# EAGLE design gpsclock (EAGLE 7.4.0)
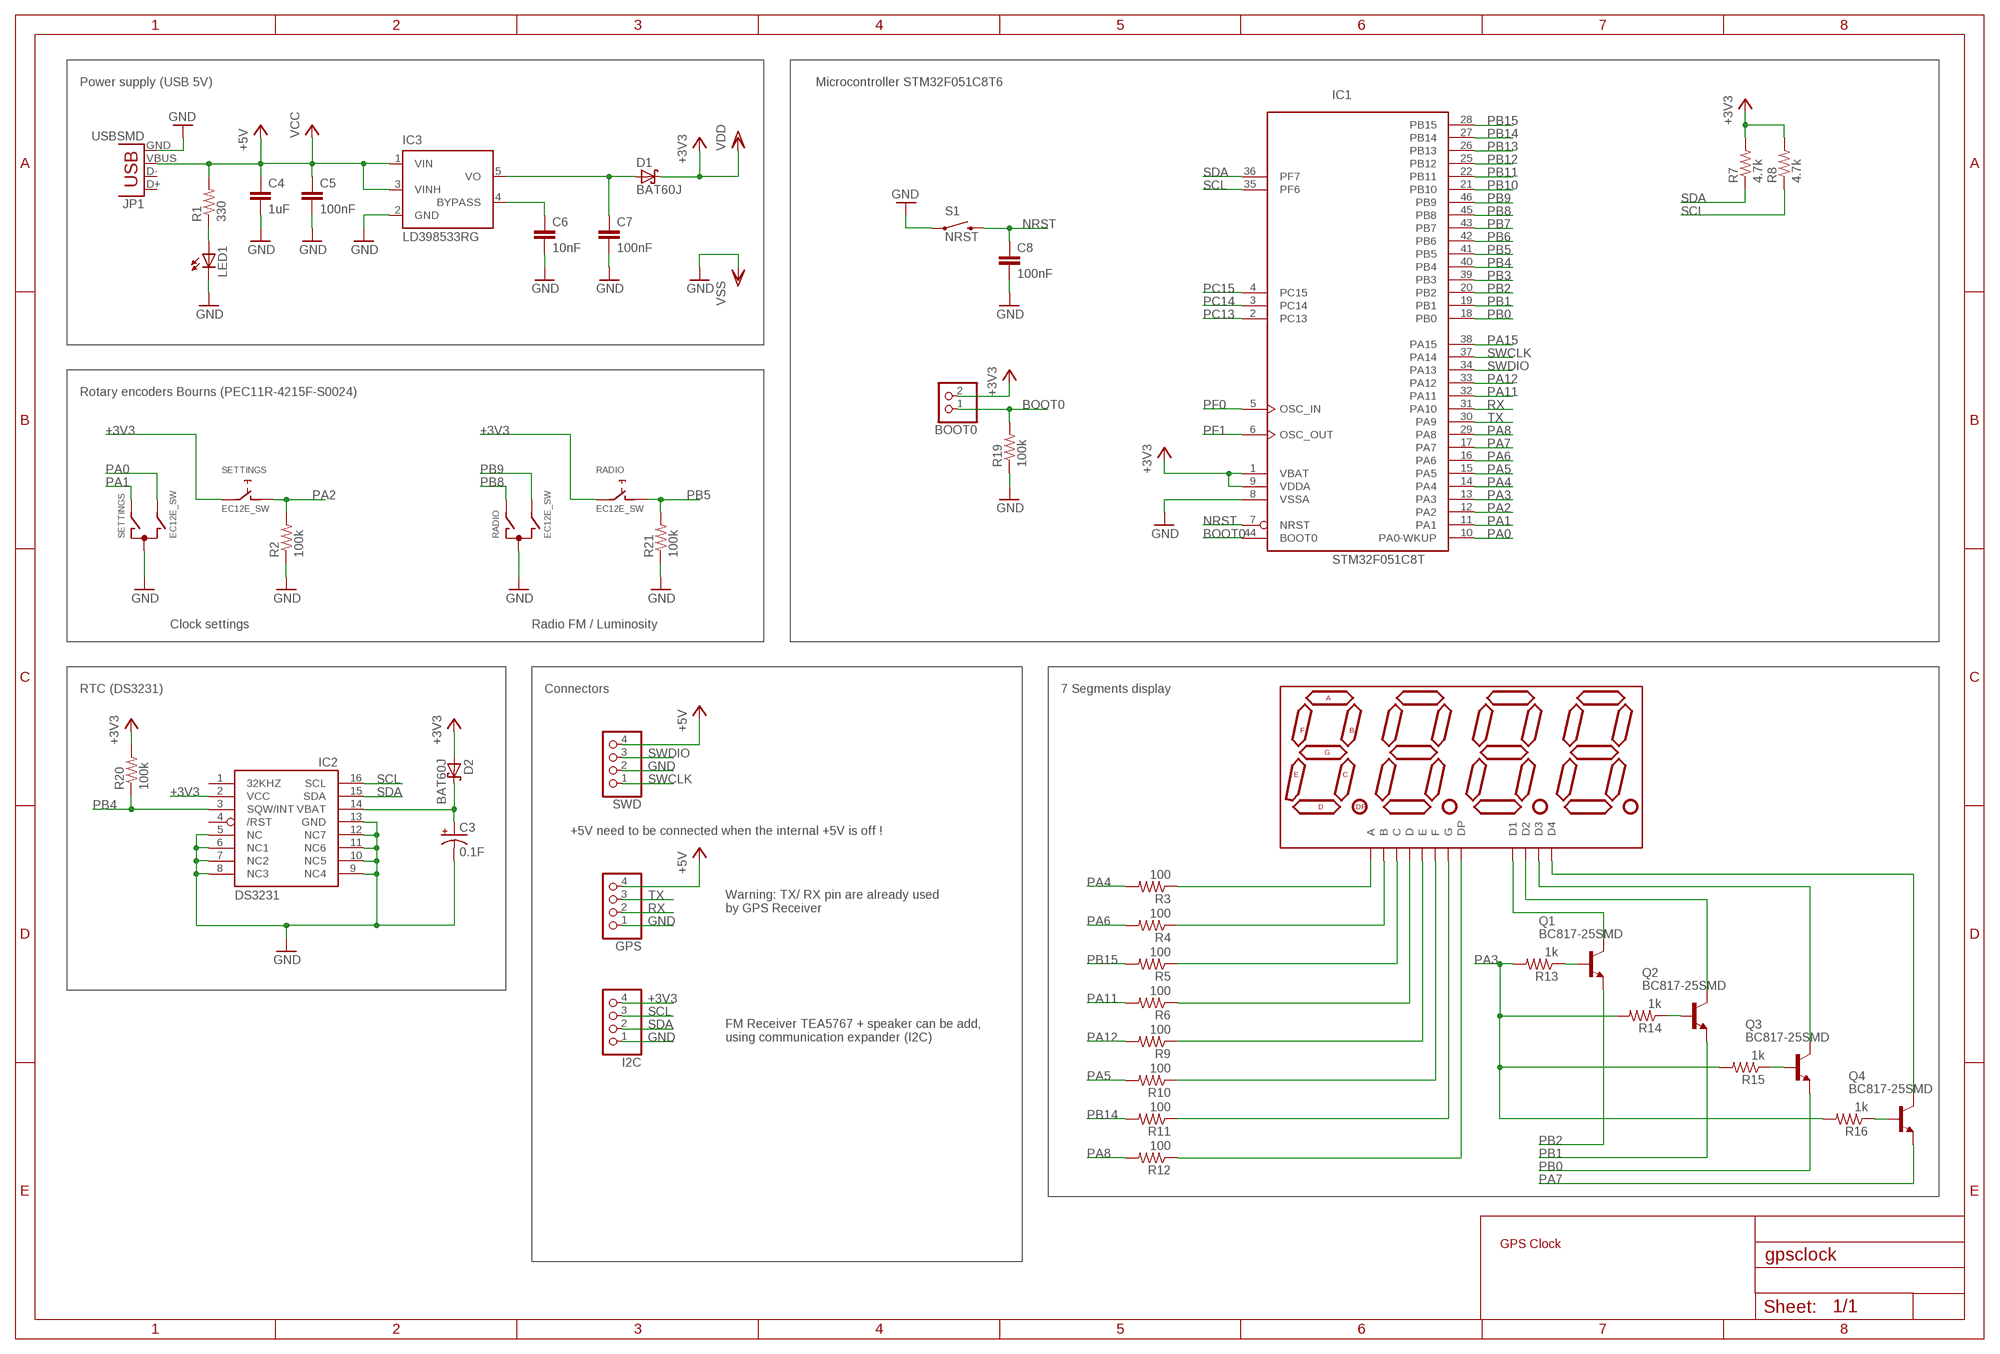
[diagram p0: schematic, sheet 1]

## Parts
7SEG  7-SEGMENT-4DIGIT-COUNTER  [CC56-21SURKWA]
BOOT0  PINHD-1X2  [1X02]
C3  0.1F  CAP_POLPTH4  [CPOL-RADIAL-1000UF-25V]
C4  1uF  C-EUC0805  [C0805]
C5  100nF  C-EUC1206  [C1206]
C6  10nF  C-EUC0805  [C0805]
C7  100nF  C-EUC1206  [C1206]
C8  100nF  C-EUC1206  [C1206]
D1  BAT60J  [SOD323_ST]
D2  BAT60J  [SOD323_ST]
GPS  PINHD-1X4  [1X04]
I2C  PINHD-1X4  [1X04]
IC1  STM32F051C8T  [LQFP48]
IC2  DS3231/SO  [SO16W]
IC3  LD398533RG  [TSOT23-5L]
JP1  USBSMD  [USB-MINIB]
LED1  LEDCHIPLED_1206  [CHIPLED_1206]
Q1  BC817-25SMD  [SOT23-BEC]
Q2  BC817-25SMD  [SOT23-BEC]
Q3  BC817-25SMD  [SOT23-BEC]
Q4  BC817-25SMD  [SOT23-BEC]
R1  330  R-US_R1206  [R1206]
R2  100k  R-US_R1206  [R1206]
R3  100  R-US_R1206  [R1206]
R4  100  R-US_R1206  [R1206]
R5  100  R-US_R1206  [R1206]
R6  100  R-US_R1206  [R1206]
R7  4.7k  R-US_R0805  [R0805]
R8  4.7k  R-US_R0805  [R0805]
R9  100  R-US_R1206  [R1206]
R10  100  R-US_R1206  [R1206]
R11  100  R-US_R1206  [R1206]
R12  100  R-US_R1206  [R1206]
R13  1k  R-US_R1206  [R1206]
R14  1k  R-US_R1206  [R1206]
R15  1k  R-US_R1206  [R1206]
R16  1k  R-US_R1206  [R1206]
R19  100k  R-US_R1206  [R1206]
R20  100k  R-US_R1206  [R1206]
R21  100k  R-US_R1206  [R1206]
RADIO  EC12E_SW  [ALPS_EC12E_SW]
S1  NRST  SWITCH-MOMENTARY-2SMD-REDUNDANT  [TACTILE-SWITCH-SMD]
SETTINGS  EC12E_SW  [ALPS_EC12E_SW]
SWD  PINHD-1X4  [1X04]

## Nets
+3V3: BOOT0.2 D1.C D2.A I2C.4 IC1.1(VBAT) IC1.9(VDDA) IC2.2(VCC) R7.2 R8.2 R20.2 RADIO.E SETTINGS.E ; supply symbol labelled VDD
+5V: C4.1 C5.1 GPS.4 IC3.1(VIN) IC3.3(VINH) JP1.VBUS R1.2 SWD.4 ; supply symbol labelled VCC
BOOT0: BOOT0.1 IC1.44(BOOT0) R19.2
GND: C3.2(-) C4.2 C5.2 C6.2 C7.2 C8.2 GPS.1 I2C.1 IC1.8(VSSA) IC2.5(NC) IC2.6(NC1) IC2.7(NC2) IC2.8(NC3) IC2.9(NC4) IC2.10(NC5) IC2.11(NC6) IC2.12(NC7) IC2.13(GND) IC3.2(GND) JP1.GND LED1.C R2.1 R19.1 R21.1 RADIO.C S1.1 S1.2 SETTINGS.C SWD.2 ; supply symbol labelled VSS
N$1: 7SEG.10(F) R10.1
N$2: 7SEG.9(D2) Q2.C
N$3: 7SEG.6(D4) Q4.C
N$4: LED1.A R1.1
N$5: Q2.B R14.1
N$6: 7SEG.11(A) R3.1
N$7: 7SEG.7(B) R4.1
N$8: C6.1 IC3.4(BYPASS)
N$9: C7.1 D1.A IC3.5(VO)
N$10: 7SEG.4(C) R5.1
N$11: 7SEG.2(D) R6.1
N$12: 7SEG.1(E) R9.1
N$13: 7SEG.5(G) R11.1
N$14: 7SEG.3(DP) R12.1
N$15: Q3.B R15.1
N$16: 7SEG.8(D3) Q3.C
N$19: C3.1(+) D2.C IC2.14(VBAT)
N$22: Q1.B R13.1
N$23: 7SEG.12(D1) Q1.C
N$24: Q4.B R16.1
NRST: C8.1 IC1.7(NRST) S1.3 S1.4
PA0: IC1.10(PA0-WKUP) SETTINGS.B
PA1: IC1.11(PA1) SETTINGS.A
PA2: IC1.12(PA2) R2.2 SETTINGS.D
PA3: IC1.13(PA3) R13.2 R14.2 R15.2 R16.2
PA4: IC1.14(PA4) R3.2
PA5: IC1.15(PA5) R10.2
PA6: IC1.16(PA6) R4.2
PA7: IC1.17(PA7) Q4.E
PA8: IC1.29(PA8) R12.2
PA11: IC1.32(PA11) R6.2
PA12: IC1.33(PA12) R9.2
PA15: IC1.38(PA15)
PB0: IC1.18(PB0) Q3.E
PB1: IC1.19(PB1) Q2.E
PB2: IC1.20(PB2) Q1.E
PB3: IC1.39(PB3)
PB4: IC1.40(PB4) IC2.3(SQW/INT) R20.1
PB5: IC1.41(PB5) R21.2 RADIO.D
PB6: IC1.42(PB6)
PB7: IC1.43(PB7)
PB8: IC1.45(PB8) RADIO.A
PB9: IC1.46(PB9) RADIO.B
PB10: IC1.21(PB10)
PB11: IC1.22(PB11)
PB12: IC1.25(PB12)
PB13: IC1.26(PB13)
PB14: IC1.27(PB14) R11.2
PB15: IC1.28(PB15) R5.2
PC13: IC1.2(PC13)
PC14: IC1.3(PC14)
PC15: IC1.4(PC15)
PF0: IC1.5(OSC_IN)
PF1: IC1.6(OSC_OUT)
RX: GPS.2 IC1.31(PA10)
SCL: I2C.3 IC1.35(PF6) IC2.16(SCL) R8.1
SDA: I2C.2 IC1.36(PF7) IC2.15(SDA) R7.1
SWCLK: IC1.37(PA14) SWD.1
SWDIO: IC1.34(PA13) SWD.3
TX: GPS.3 IC1.30(PA9)
Unconnected: IC2.1(32KHZ) IC2.4(/RST) JP1.D+ JP1.D- RADIO.GND1(G) RADIO.GND2(G) SETTINGS.GND1(G) SETTINGS.GND2(G)

## Notes on the sheet
- Power supply (USB 5V) | Microcontroller STM32F051C8T6
- Rotary encoders Bourns (PEC11R-4215F-S0024)
- Clock settings | Radio FM / Luminosity
- RTC (DS3231) | Connectors | 7 Segments display
- +5V need to be connected when the internal +5V is off !
- Warning: TX/ RX pin are already used
  by GPS Receiver
- FM Receiver TEA5767 + speaker can be add,
  using communication expander (I2C)
- GPS Clock

## Power pins joined to a net without a drawn wire
+3V3: IC1.24(VDD) IC1.48(VDD)
GND: IC1.23(VSS) IC1.47(VSS)

## Library data of the parts
7SEG = cc56-21surkwa:7-SEGMENT-4DIGIT-COUNTER
BOOT0 = pinhead:PINHD-1X2: PIN HEADER
C3 = SparkFun-Passives:CAP_POL: Capacitor Polarized These are standard SMD and PTH capacitors. Normally 10uF, 47uF, and 100uF in electrolytic and tantalum varieties. Always verify the external diameter of the through hole cap, it varies with capacity, voltage, and manufacturer. The EIA devices should be standard.
C4-C8 = rcl:C-EU: CAPACITOR, European symbol
D1 D2 = diode:BAT60J: Schottky barrier diode Source: www.st.com, BAT60J.pdf
GPS I2C SWD = pinhead:PINHD-1X4: PIN HEADER
IC1 = micro-stm_v2:STM32F051C*T: ARM 32-bit Cortex™-M0 CPU 48 MHz maximum frequency 16 to 64 Kbytes of Flash memory 4 to 8 kbytes of SRAM 39 GPIOs 2.0 to 3.6 V application supply
IC2 = adafruit:DS3231
IC3 = st-microelectronics:LD3985: Ultra low drop and low noise BiCMOS voltage regulators Source: www.st.com LD3985.pdf
JP1 = SparkFun-Connectors:USB: USB Connectors USB-B-PTH is fully proven SKU : PRT-00139/CONN-08278 USB-miniB is fully proven SKU : PRT-00587 USB-A-PCB is untested. USB-A-H is throughly reviewed, but untested. Spark Fun Electronics SKU : PRT-00437 USB-B-SMT is throughly reviewed, but untested. Needs silkscreen touching up. USB-A-S has not been used/tested USB-MB-H has not been used/tested USB-MICROB has been used. CONN-09505; PROD_ID: CONN-08193
LED1 = led:LED: LED OSRAM: - CHIPLED LG R971, LG N971, LY N971, LG Q971, LY Q971, LO R971, LY R971 LH N974, LH R974 LS Q976, LO Q976, LY Q976 LO Q996 - Hyper CHIPLED LW Q18S LB Q993, LB Q99A, LB R99A - SideLED LS A670, LO A670, LY A670, LG A670, LP A670 LB A673, LV A673, LT A673, LW A673 LH A674 LY A675 LS A676, LA A676, LO A676, LY A676, LW A676 LS A679, LY A679, LG A679 - Hyper Micro SIDELED® LS Y876, LA Y876, LO Y876, LY Y876 LT Y87S - SmartLED LW L88C, LW L88S LB L89C, LB L89S, LG L890 LS L89K, LO L89K, LY L89K LS L896, LA L896, LO L896, LY L896 - TOPLED LS T670, LO T670, LY T670, LG T670, LP T670 LSG T670, LSP T670, LSY T670, LOP T670, LYG T670 LG T671, LOG T671, LSG T671 LB T673, LV T673, LT T673, LW T673 LH T674 LS T676, LA T676, LO T676, LY T676, LB T676, LH T676, LSB T676, LW T676 LB T67C, LV T67C, LT T67C, LS T67K, LO T67K, LY T67K, LW E67C LS E67B, LA E67B, LO E67B, LY E67B, LB E67C, LV E67C, LT E67C LW T67C LS T679, LY T679, LG T679 LS T770, LO T770, LY T770, LG T770, LP T770 LB T773, LV T773, LT T773, LW T773 LH T774 LS E675, LA E675, LY E675, LS T675 LS T776, LA T776, LO T776, LY T776, LB T776 LHGB T686 LT T68C, LB T68C - Hyper Mini TOPLED® LB M676 - Mini TOPLED Santana® LG M470 LS M47K, LO M47K, LY M47K Source: http://www.osram.convergy.de LUXEON: - LUMILED® LXK2-PW12-R00, LXK2-PW12-S00, LXK2-PW14-U00, LXK2-PW14-V00 LXK2-PM12-R00, LXK2-PM12-S00, LXK2-PM14-U00 LXK2-PE12-Q00, LXK2-PE12-R00, LXK2-PE12-S00, LXK2-PE14-T00, LXK2-PE14-U00 LXK2-PB12-K00, LXK2-PB12-L00, LXK2-PB12-M00, LXK2-PB14-N00, LXK2-PB14-P00, LXK2-PB14-Q00 LXK2-PR12-L00, LXK2-PR12-M00, LXK2-PR14-Q00, LXK2-PR14-R00 LXK2-PD12-Q00, LXK2-PD12-R00, LXK2-PD12-S00 LXK2-PH12-R00, LXK2-PH12-S00 LXK2-PL12-P00, LXK2-PL12-Q00, LXK2-PL12-R00 Source: www.luxeon.com KINGBRIGHT: KA-3528ASYC Source: www.kingbright.com
Q1-Q4 = transistor-npn:BC817*: NPN Transistor
R1-R16 R19-R21 = rcl:R-US_: RESISTOR, American symbol
RADIO SETTINGS = switch-alps:EC12E_SW: ALPS rotary Encoder EC12E series with switch; MPN: EC12E2424407; OC_FARNELL: 1520813; OC_NEWARK: 74M1068
S1 = SparkFun-Electromechanical:SWITCH-MOMENTARY-2: Various NO switches- pushbuttons, reed, etc; PROD_ID: SWCH-08247

## Board
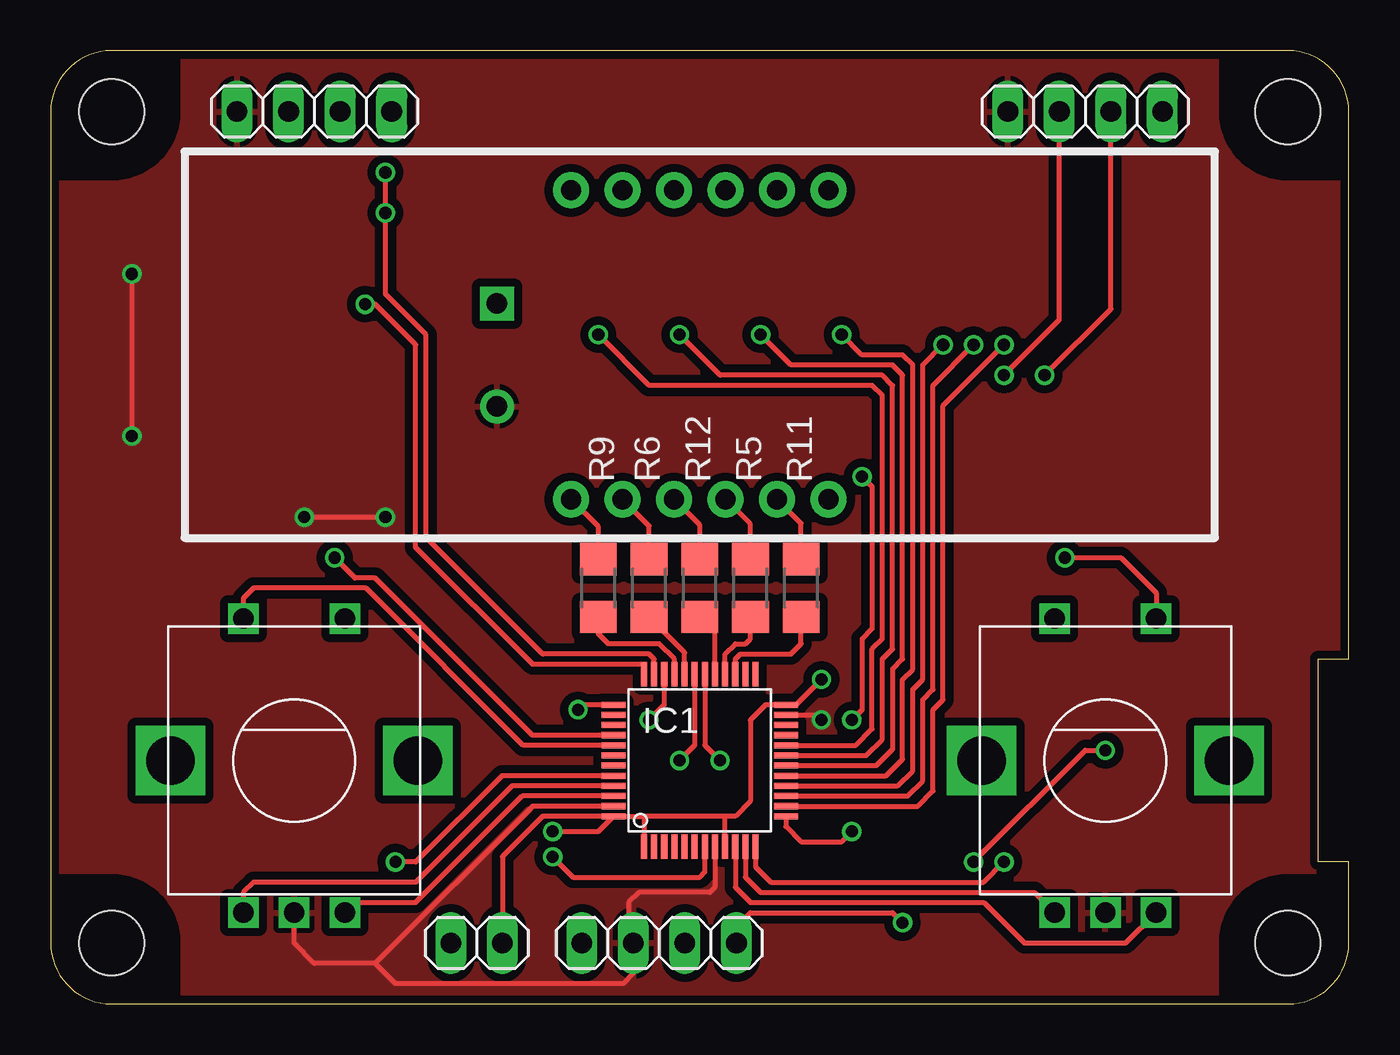
[diagram p1: board, top side]
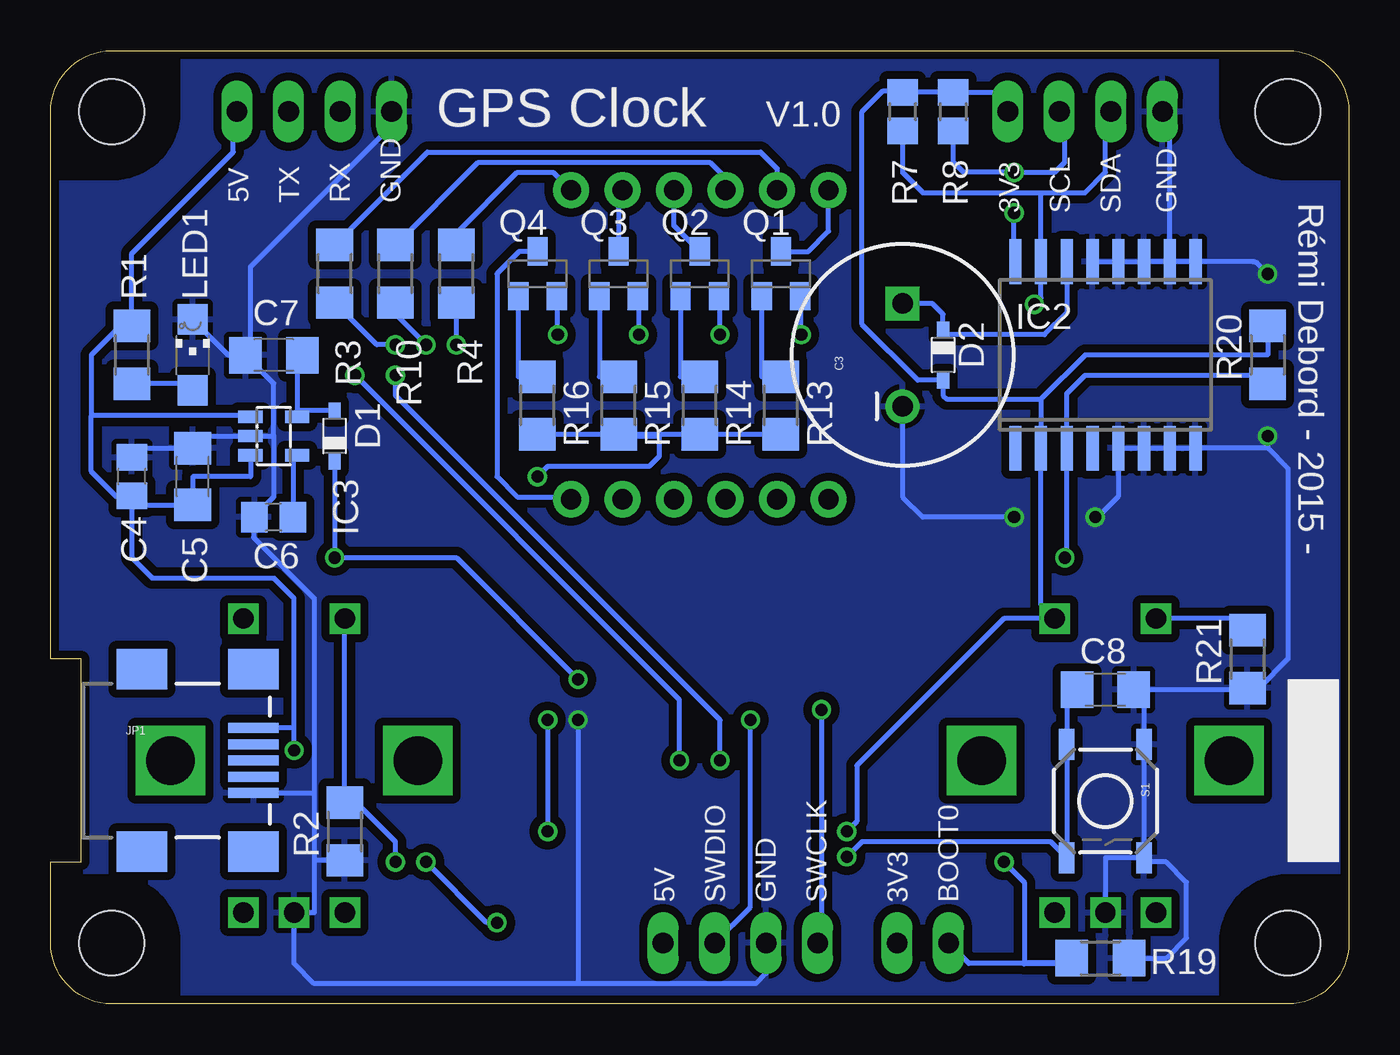
[diagram p2: board, bottom side, seen from below]

Size 64 x 47 mm. Coordinates in mm from the lower left corner, seen from the top.
Outline: 61,47 3,47 arc90 0,44 0,3 arc90 3,0 61,0 arc90 64,3 64,7 62.5,7 62.5,17 64,17 64,44 arc90 61,47
Copper layers (1*16): Top 0.0356mm / dielectric 1.5011mm / Bottom 0.0356mm
Design rules "LaenPCBOrder": minimum track width 6mil, minimum drill 13mil, track to track 6mil, track to pad 6mil, pad to pad 6mil, via to via 6mil, smd to smd 6mil, copper to edge 15mil, drill to drill 6mil, minimum pad ring 7mil, minimum via ring 7mil, stop-mask expansion 3mil, vias tented up to drill 0mil, thermal gap 10mil
Holes 3.2 mm at 3,44 61,44 3,3 61,3
tKeepout: 12 lines
bKeepout: 12 lines
tRestrict: area 0,41 to 6,47; area 58,0 to 64,6; area 0,0 to 6,6; area 58,41 to 64,47
bRestrict: area 0,41 to 6,47; area 58,0 to 64,6; area 58,41 to 64,47; area 0,0 to 6,6

### Footprints (pad centres in the part's own frame; a part is rotated, then mirrored left to right if it is on the bottom)
CC56-21SURKWA = drill 1 pad 1.778: 1 -6.35,-7.62; 2 -3.81,-7.62; 3 -1.27,-7.62; 4 1.27,-7.62; 5 3.81,-7.62; 6 6.35,-7.62; 7 6.35,7.62; 8 3.81,7.62; 9 1.27,7.62; 10 -1.27,7.62; 11 -3.81,7.62; 12 -6.35,7.62
1X02 = drill 1.016 long: 1 -1.27,0; 2 1.27,0
CPOL-RADIAL-1000UF-25V = drill 1 pad 1.676 square: 1 2.54,0 | drill 1 pad 1.676: 2 -2.54,0
C0805 = smd 1.3 x 1.5: 1 -0.95,0; 2 0.95,0
C1206 = smd 1.6 x 1.8: 1 -1.4,0; 2 1.4,0
SOD323_ST = smd 0.8 x 0.6: A 1.25,0; C -1.25,0
1X04 = drill 1.016 long: 1 -3.81,0; 2 -1.27,0; 3 1.27,0; 4 3.81,0
LQFP48 = smd 0.3 x 1.2: 1 -2.75,-4.25; 2 -2.25,-4.25; 3 -1.75,-4.25; 4 -1.25,-4.25; 5 -0.75,-4.25; 6 -0.25,-4.25; 7 0.25,-4.25; 8 0.75,-4.25; 9 1.25,-4.25; 10 1.75,-4.25; 11 2.25,-4.25; 12 2.75,-4.25; 25 2.75,4.25; 26 2.25,4.25; 27 1.75,4.25; 28 1.25,4.25; 29 0.75,4.25; 30 0.25,4.25; 31 -0.25,4.25; 32 -0.75,4.25; 33 -1.25,4.25; 34 -1.75,4.25; 35 -2.25,4.25; 36 -2.75,4.25 | smd 1.2 x 0.3: 13 4.25,-2.75; 14 4.25,-2.25; 15 4.25,-1.75; 16 4.25,-1.25; 17 4.25,-0.75; 18 4.25,-0.25; 19 4.25,0.25; 20 4.25,0.75; 21 4.25,1.25; 22 4.25,1.75; 23 4.25,2.25; 24 4.25,2.75; 37 -4.25,2.75; 38 -4.25,2.25; 39 -4.25,1.75; 40 -4.25,1.25; 41 -4.25,0.75; 42 -4.25,0.25; 43 -4.25,-0.25; 44 -4.25,-0.75; 45 -4.25,-1.25; 46 -4.25,-1.75; 47 -4.25,-2.25; 48 -4.25,-2.75
SO16W = smd 0.6 x 2.2: 1 -4.445,-4.6; 2 -3.175,-4.6; 3 -1.905,-4.6; 4 -0.635,-4.6; 5 0.635,-4.6; 6 1.905,-4.6; 7 3.175,-4.6; 8 4.445,-4.6; 9 4.445,4.6; 10 3.175,4.6; 11 1.905,4.6; 12 0.635,4.6; 13 -0.635,4.6; 14 -1.905,4.6; 15 -3.175,4.6; 16 -4.445,4.6
TSOT23-5L = smd 0.6 x 1.2: 1 -0.95,-1.15; 2 0,-1.15; 3 0.95,-1.15; 4 0.95,1.15; 5 -0.95,1.15
USB-MINIB = smd 2.5 x 0.5: D+ 2.5,0; D- 2.5,0.8; GND 2.5,-1.6; ID 2.5,-0.8; VBUS 2.5,1.6 | smd 2.5 x 2: MTN1 -3,4.5; MTN2 2.5,4.5; MTN3 -3,-4.5; MTN4 2.5,-4.5
CHIPLED_1206 = smd 1.5 x 1.5: A 0,-1.75; C 0,1.75
SOT23-BEC = smd 1 x 1.4: B -0.95,-1.1; C 0,1.1; E 0.95,-1.1
R1206 = smd 1.6 x 1.803: 1 -1.422,0; 2 1.422,0
R0805 = smd 1.3 x 1.5: 1 -0.95,0; 2 0.95,0
ALPS_EC12E_SW = drill 1 square: A -2.5,-7.5; B 2.5,-7.5; C 0,-7.5; D -2.5,7; E 2.5,7 | drill 2.4 pad 3.2 square: GND1 -6.1,0; GND2 6.1,0
TACTILE-SWITCH-SMD = smd 1.524 x 0.762: 1 -2.794,1.905; 2 2.794,1.905; 3 -2.794,-1.905; 4 2.794,-1.905

### Placement (x,y rotation side)
7SEG  32,32.5 0 top
BOOT0  21,3 0 top
C3  22,32 90 bottom
C4  60,26 90 bottom
C5  57,26 90 bottom
C6  53,24 180 bottom
C7  53,31.99 180 bottom
C8  12,15.5 0 bottom
D1  50,28 90 bottom
D2  20,32 270 bottom
GPS  51,44 0 top
I2C  13,44 0 top
IC1  32,12 0 top
IC2  12,32 0 bottom
IC3  53,28 270 bottom
JP1  56.5,12 0 bottom
LED1  57,32 0 bottom
Q1  28,36 0 bottom
Q2  32,36 0 bottom
Q3  36,36 0 bottom
Q4  40,36 0 bottom
R1  60,32 90 bottom
R2  49.5,8.5 90 bottom
R3  50,36 270 bottom
R4  44,36 270 bottom
R5  34.5,20.5 270 top
R6  29.5,20.5 270 top
R7  22,44 90 bottom
R8  19.5,44 90 bottom
R9  27,20.5 270 top
R10  47,36 270 bottom
R11  37,20.5 270 top
R12  32,20.5 270 top
R13  28,29.5 270 bottom
R14  32,29.5 270 bottom
R15  36,29.5 270 bottom
R16  40,29.5 270 bottom
R19  12.25,2.25 180 bottom
R20  4,32 90 bottom
R21  5,17 90 bottom
RADIO  12,12 0 top
S1  12,10 270 bottom
SETTINGS  52,12 0 top
SWD  30,3 0 top

### Tracks (layer width: path | path; a pad name or v marks a point on that pad's centre or on a via)
+3V3  (via drill 0.6)
  Top 0.254: IC1.48 29.25,9.25 | 29.25,9.25 IC1.1 | IC1.9 33.25,9.25 | 33.25,9.25 29.25,9.25 | 33.25,9.25 33.75,9.25 34.5,10 34.5,14 35.25,14.75 IC1.24 36.75,14.75 v38,16 | v50,22 52.75,22 54.5,20.25 SETTINGS.E | IC1.48 24.25,9.25 22.27,7.27 BOOT0.2 | v24.75,8.5 27,8.5 IC1.48
  Bottom 0.254: R8.2 19,44.95 | 19,44.95 16.81,44.95 I2C.4 | R20.2 4,32 13,32 15.17,29.83 | 19,44.95 arc-90 19.05,45 19.1,44.95 R7.2 22.05,45 23,45 24,44 24,33.5 21.25,30.75 D2.A 20,30 19.83,29.83 15.17,29.83 | 15.17,29.83 IC2.2 15.17,19.67 RADIO.E 17,19 24.25,11.75 24.25,9 v24.75,8.5 | D1.C v50,22 44,22 v38,16
+5V  (via drill 0.6)
  Top 0.254: SWD.4 33.81,3.81 34.5,4.5 41.5,4.5 v42,4 | v45.5,7 51,12.5 v52,12.5
  Bottom 0.254: 60,25 60,24.6 | 60,24.6 C5.1 57,26 54.15,26 IC3.3 | 60,24.6 60,22 59,21 53,21 52,20 52,13.6 | 60,25 C4.1 | v52,12.5 52,13.6 | 52,13.6 JP1.VBUS | GPS.4 55,44 55,42 60,37 R1.2 60.58,33.42 62,32 62,29 | IC3.1 54.15,29 62,29 | 60,25 60.75,25 62,26.25 62,29 | v42,4 42.5,4 v45.5,7
BOOT0  (via drill 0.6)
  Top 0.254: IC1.44 22.25,11.25 18,7 v17,7
  Bottom 0.254: BOOT0.1 18.73,2 16,2 16,6 v17,7
  Bottom 0.305: R19.2 13.92,2 16,2
GND  (via drill 0.6)
  Top 0.254: v4,36 v4,28 | v12.5,24 v16.5,24 | 37.95,14.05 v38,14 37.75,14.25 IC1.23 | IC1.47 23.75,9.75 16,2 | IC1.8 32.75,5.75 32.5,5.5 29,5.5 28.5,5 28.5,3 SWD.2 28.73,1.5 28.23,1 17,1 16,2 | RADIO.C 12,3 13,2 16,2
  Bottom 0.254: C7.2 54.15,31.99 54.15,36.35 47.19,43.31 GPS.1 | 53.5,24 C6.2 54,24 | 51,10.4 51,7.08 | 51,7.08 51,4.5 SETTINGS.C 52,2 51,1 38,1 | C4.2 60,27.4 C5.2 57,28 IC3.2 53,28 | 53,28 53,25 54,24 | IC2.10 8.82,44 I2C.1 | IC2.10 IC2.9 4.74,36.6 arc45 4.5,36.5 v4,36 | IC2.10 IC2.11 IC2.12 IC2.13 | IC2.6 IC2.5 11.37,25.01 12.38,24 v12.5,24 | IC2.6 IC2.7 IC2.8 | v4,28 4,27.4 | 4,27.4 IC2.8 | S1.2 S1.1 10.09,14.99 C8.2 5,15.5 R21.1 4.42,15.58 3,17 3,26.4 4,27.4 | RADIO.C 12,7.21 S1.2 | IC2.6 IC2.8 | R19.1 9,2.25 8,3.25 8,6 9,7 10.09,7 S1.2 | 38,1 29.23,1 28.73,1.5 SWD.2 | 54,24 54,23 51,20 51,10.4 | R2.1 51,7.08 | JP1.GND 51,10.4 | v16.5,24 21,24 22,25 C3.2 | C7.2 55.24,31.99 LED1.C | v38,14 38,1 | 53,28 53,30.59 C7.2
  pour Top (isolate 0.406): -3,50 -3,-3 67,-3 67,50
  pour Bottom (isolate 0.406): -2,49 -2,-2 66,-2 66,49
N$1
  Bottom 0.254: R10.1 42.92,41.5 31.5,41.5 30.73,40.73 7SEG.10
N$2
  Bottom 0.254: Q2.C 33.27,38.37 7SEG.9
N$3
  Bottom 0.254: Q4.C 40.9,37.1 42,36 42,26 41,25 38.47,25 arc90 7SEG.6
N$4
  Bottom 0.254: LED1.A 57,30.58 R1.1
N$5
  Bottom 0.254: Q2.B 32.95,30.92 R14.1
N$6
  Bottom 0.254: R3.1 45.42,42 29,42 28.19,41.19 7SEG.11
N$7
  Bottom 0.254: R4.1 44,38 41,41 39.23,41 7SEG.7
N$8
  Bottom 0.254: IC3.4 52.05,27.05 C6.1
N$9
  Bottom 0.254: C7.1 51.85,31.99 IC3.5 51.85,29.25 D1.A
N$10
  Top 0.254: R5.1 34.5,23.65 7SEG.4
N$11
  Top 0.254: R6.1 29.5,23.57 7SEG.2
N$12
  Top 0.254: R9.1 27,23.53 7SEG.1
N$13
  Top 0.254: R11.1 37,23.69 7SEG.5
N$14
  Top 0.254: R12.1 32,23.61 7SEG.3
N$15
  Bottom 0.254: Q3.B 36.95,30.92 R15.1
N$16
  Bottom 0.254: 7SEG.8 36,40.12 Q3.C
N$19
  Bottom 0.254: IC2.14 13.91,34.09 15,33 20,33 D2.C 20,34 20.54,34.54 C3.1
N$22
  Bottom 0.254: Q1.B 28.95,30.92 R13.1
N$23
  Bottom 0.254: Q1.C 26.65,37.1 25.65,38.1 7SEG.12
N$24
  Bottom 0.254: Q4.B 40.95,30.92 R16.1
NRST  (via drill 0.6)
  Top 0.254: v24.75,7.25 25.75,6.25 32,6.25 32.25,6.5 IC1.7
  Bottom 0.254: C8.1 13.91,14.99 S1.3 S1.4 14.7,8 24,8 v24.75,7.25
PA0
  Top 0.254: SETTINGS.B 53,3 48,3 46,5 34.5,5 33.75,5.75 IC1.10
PA1
  Top 0.254: SETTINGS.A 48.5,5.5 35,5.5 34.25,6.25 IC1.11
PA2  (via drill 0.6)
  Top 0.254: v47,7 46,6 35.5,6 34.75,6.75 IC1.12
  Bottom 0.254: SETTINGS.D R2.2 48.92,9.92 47,8 v47,7
PA3  (via drill 0.6)
  Top 0.254: v40,26 40.5,25.5 40.5,18.5 40,18 40,14.5 v39.5,14 | IC1.13 36.25,8.75 37,8 39,8 v39.5,8.5
  Bottom 0.254: R13.2 R14.2 R15.2 | R15.2 R16.2 | R15.2 36,28 34,28 34,27 34.5,26.5 39.5,26.5 v40,26 | v39.5,14 v39.5,8.5
PA4  (via drill 0.6)
  Top 0.254: v47,32.5 44,29.5 44,15 43.5,14.5 43.5,10.5 42.75,9.75 IC1.14
  Bottom 0.254: v47,32.5 47.92,32.5 R3.2
PA5  (via drill 0.6)
  Top 0.254: v45.5,32.5 43.5,30.5 43.5,15.5 43,15 43,11 42.25,10.25 IC1.15
  Bottom 0.254: v45.5,32.5 47,34 R10.2
PA6  (via drill 0.6)
  Top 0.254: v44,32.5 43,31.5 43,16 42.5,15.5 42.5,11.5 41.75,10.75 IC1.16
  Bottom 0.254: v44,32.5 R4.2
PA7  (via drill 0.6)
  Top 0.254: v39,33 40,32 42,32 42.5,31.5 42.5,16.5 42,16 42,12.06 41.19,11.25 IC1.17
  Bottom 0.254: v39,33 39,34.9 Q4.E
PA8
  Top 0.254: IC1.29 32.75,19.08 R12.2
PA11
  Top 0.254: IC1.32 31.25,17.33 R6.2
PA12
  Top 0.254: IC1.33 30.75,17 30,17.75 27.5,17.75 27,18.25 R9.2
PB0  (via drill 0.6)
  Top 0.254: v35,33 36.5,31.5 41.5,31.5 42,31 42,17 41.5,16.5 41.5,12.55 40.7,11.75 IC1.18
  Bottom 0.254: v35,33 35,34.9 Q3.E
PB1  (via drill 0.6)
  Top 0.254: v31,33 33,31 41,31 41.5,30.5 41.5,17.5 41,17 41,13.05 40.2,12.25 IC1.19
  Bottom 0.254: v31,33 31,34.9 Q2.E
PB2  (via drill 0.6)
  Top 0.254: v27,33 29.5,30.5 40.5,30.5 41,30 41,18 40.5,17.5 40.5,13.55 39.7,12.75 IC1.20
  Bottom 0.254: v27,33 27,34.9 Q1.E
PB4  (via drill 0.6)
  Top 0.254: v14,22 15,21 16,21 23.75,13.25 IC1.40
  Bottom 0.254: R20.1 4,31 13,31 13.91,30.09 IC2.3 13.91,22.09 v14,22
PB5
  Top 0.254: RADIO.D 9.5,20 10,20.5 15.55,20.5 23.3,12.75 IC1.41
  Bottom 0.254: R21.2 5.58,19 RADIO.D
PB8
  Top 0.254: RADIO.A 9.5,5.5 10,6 18,6 22.75,10.75 IC1.45
PB9
  Top 0.254: RADIO.B 15,5 18,5 23.25,10.25 IC1.46
PB14
  Top 0.254: IC1.27 33.75,17 34,17.25 36.5,17.25 37,17.75 R11.2
PB15
  Top 0.254: IC1.28 33.25,17.25 33.75,17.75 34.25,17.75 34.5,18 R5.2
RX  (via drill 0.6)
  Top 0.254: IC1.31 31.75,12.75 v31,12 | v47,31 49.73,33.73 GPS.2
  Bottom 0.254: v31,12 31,14 47,30 v47,31
SCL  (via drill 0.6)
  Top 0.254: v16.5,41 v16.5,39 16.5,35 18.5,33 18.5,23 24.25,17.25 29.5,17.25 29.75,17 IC1.35
  Bottom 0.254: IC2.16 16.5,36.66 v16.5,39 | R8.1 19.5,41.5 19,41 v16.5,41 14.5,41 14,41.5 14,44 I2C.3
SDA  (via drill 0.6)
  Top 0.254: v15.5,34.5 16,34.5 18,32.5 18,22.5 23.75,16.75 29.25,16.75 IC1.36
  Bottom 0.254: I2C.2 12,44 12,41 13,40 15.17,40 | 15.17,40 IC2.15 15.17,34.83 v15.5,34.5 | 15.17,40 21,40 22,41 R7.1
SWCLK  (via drill 0.6)
  Top 0.254: IC1.37 26.25,14.75 v26,14.5
  Bottom 0.254: v26,14.5 26,3.19 SWD.1
SWDIO  (via drill 0.6)
  Top 0.254: IC1.34 30.25,14.75 v29.5,14
  Bottom 0.254: SWD.3 29.5,4.77 v29.5,14
TX  (via drill 0.6)
  Top 0.254: IC1.30 32.25,12.75 v33,12 | v49,31 52.27,34.27 GPS.3
  Bottom 0.254: v33,12 33,15 v49,31

### Text on the board
bNames: V1.0 | GPS Clock | Rémi Debord - 2015 - | GND | SDA | SCL | 3V3 | GND | RX | TX | 5V | BOOT0 | 3V3 | SWCLK | GND | SWDIO | 5V